# EAGLE design imu shield (EAGLE 7.3.0)
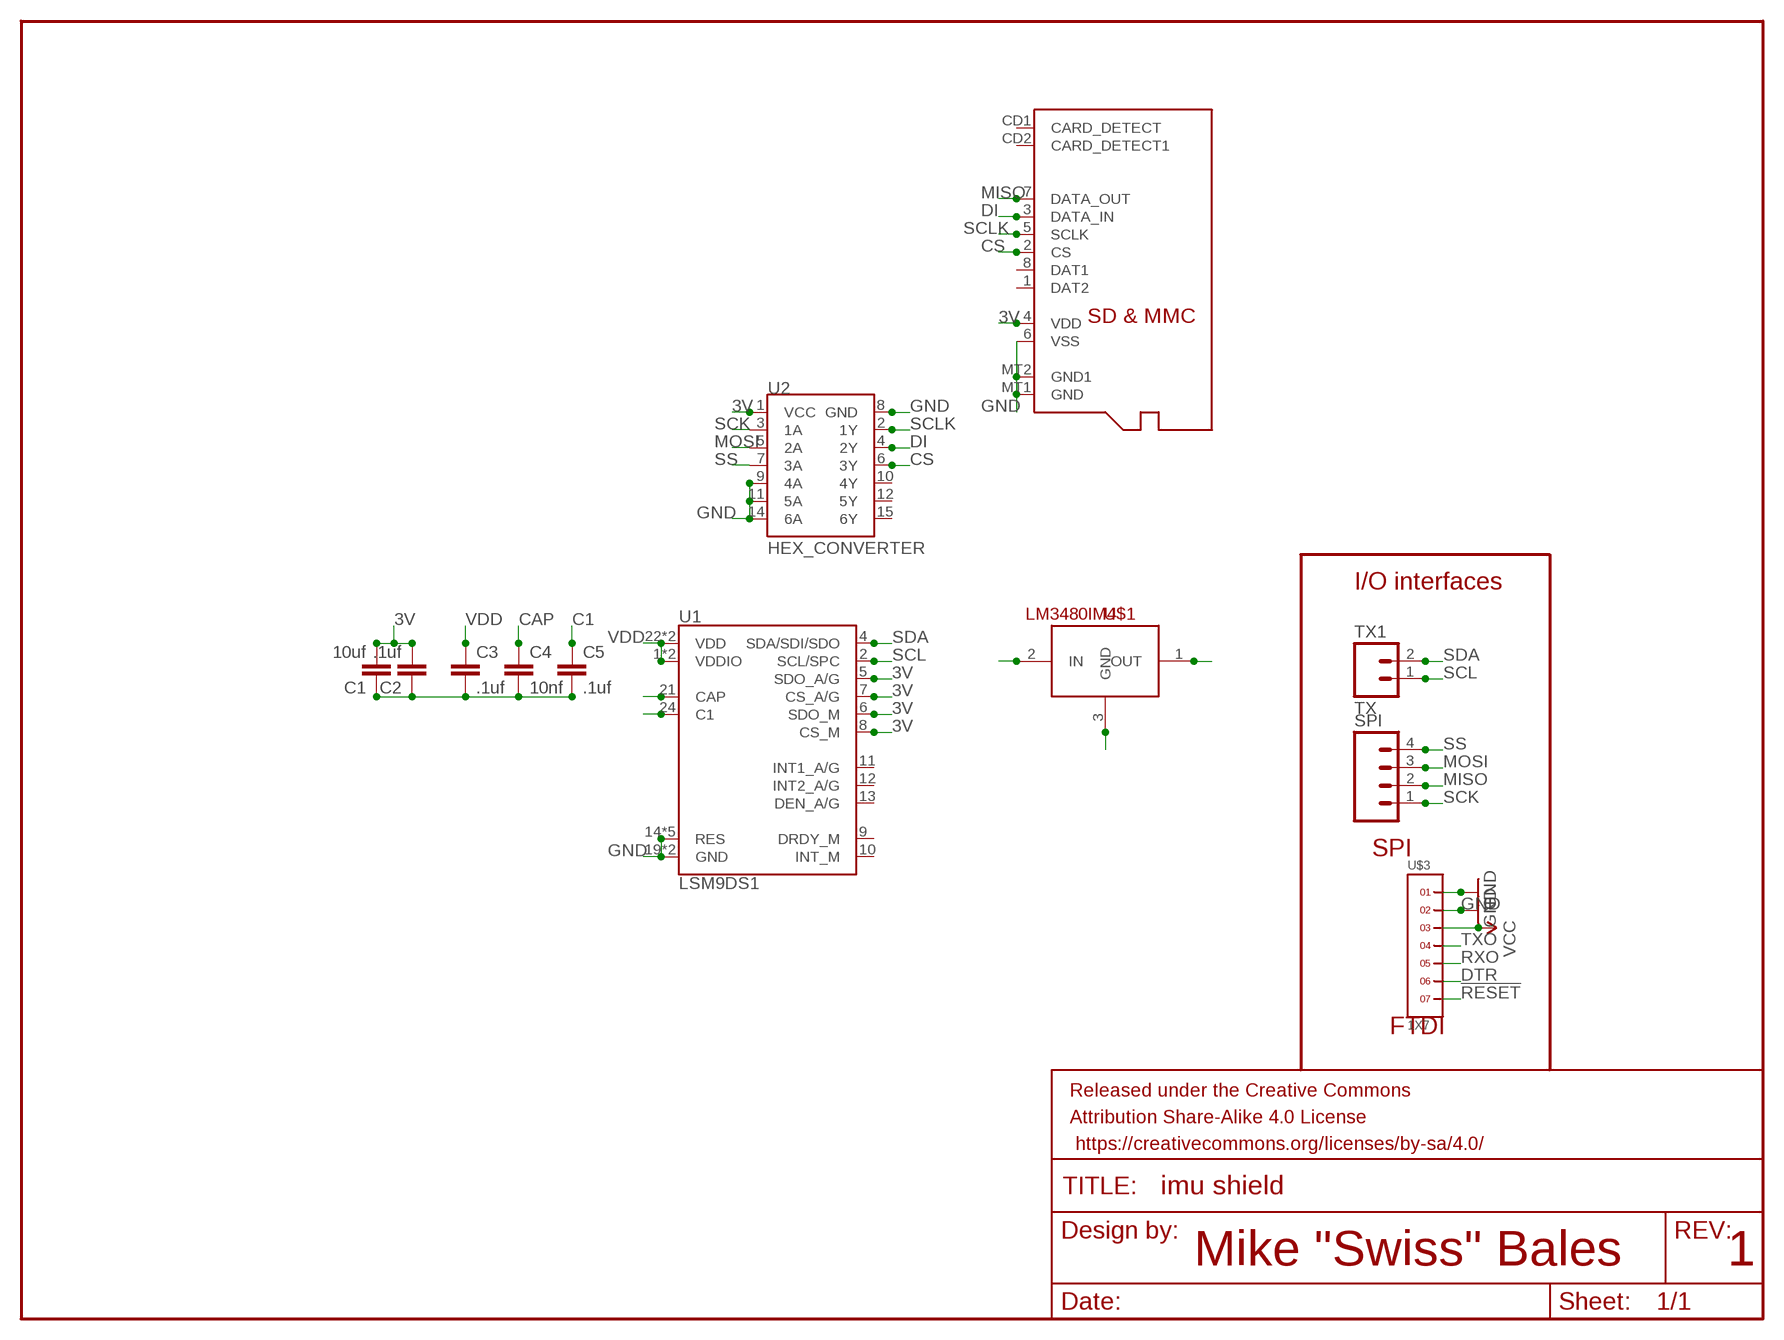
[diagram p0: schematic, sheet 1]

## Parts
C1  10uf  CAP0805  [0805]
C2  .1uf  CAP0805  [0805]
C3  .1uf  CAP0805  [0805]
C4  10nf  CAP0805  [0805]
C5  .1uf  CAP0805  [0805]
FRAME1  FRAME-LETTER  [CREATIVE_COMMONS]
SPI  M04JST-PTH-VERT  [JST-4-PTH-VERT]
TX1  TX  M02JST-PTH-VERT  [JST-2-PTH-VERT]
U1  LSM9DS1  [LGA24-8X4]
U2  HEX_CONVERTER  [SO016]
U$1  LM3480IM4  [SOT23-3]
U$2  MICROSD  [MICROSD]
U$3  1X7  [1X7]

## Nets
3V: C1.2 C2.2 U1.5(SDO_A/G) U1.6(SDO_M) U1.7(CS_A/G) U1.8(CS_M) U2.1(VCC) U$2.4(VDD)
!RESET: U$3.7
C1: C5.1 U1.24(C1)
CAP: C4.1 U1.21(CAP)
CS: U2.6(3Y) U$2.2(CS)
DI: U2.4(2Y) U$2.3(DATA_IN)
DTR: U$3.6
GND: U1.14(RES) U1.15(RES) U1.16(RES) U1.17(RES) U1.18(RES) U1.19(GND) U1.20(GND) U2.8(GND) U2.9(4A) U2.11(5A) U2.14(6A) U$1.3(GND) U$2.6(VSS) U$2.MT1(GND) U$2.MT2(GND1) U$3.1 U$3.2
MISO: SPI.2 U$2.7(DATA_OUT)
MOSI: SPI.3 U2.5(2A)
N$1: C1.1 C2.1 C3.2 C4.2 C5.2
RXO: U$3.5
SCK: SPI.1 U2.3(1A)
SCL: TX1.1 U1.2(SCL/SPC)
SCLK: U2.2(1Y) U$2.5(SCLK)
SDA: TX1.2 U1.4(SDA/SDI/SDO)
SS: SPI.4 U2.7(3A)
TXO: U$3.4
VCC: U$1.2(IN) U$3.3
VDD: C3.1 U1.1(VDDIO) U1.3(VDDIO) U1.22(VDD) U1.23(VDD) U$1.1(OUT)
Unconnected: U1.9(DRDY_M) U1.10(INT_M) U1.11(INT1_A/G) U1.12(INT2_A/G) U1.13(DEN_A/G) U2.10(4Y) U2.12(5Y) U2.15(6Y) U$2.1(DAT2) U$2.8(DAT1) U$2.CD1(CARD_DETECT) U$2.CD2(CARD_DETECT1)

## Notes on the sheet
- I/O interfaces
- SPI
- FTDI
- Mike "Swiss" Bales | 1

## Library data of the parts
C1-C5 = SparkFun-Passives:CAP: Capacitor Standard 0603 ceramic capacitor, and 0.1" leaded capacitor.
FRAME1 = SparkFun-Aesthetics:FRAME-LETTER: Schematic Frame Standard 8.5x11 US Letter frame
SPI = SparkFun-Connectors:M04: Header 4 Standard 4-pin 0.1" header. Use with straight break away headers (SKU : PRT-00116), right angle break away headers (PRT-00553), swiss pins (PRT-00743), machine pins (PRT-00117), and female headers (PRT-00115). Molex polarized connector foot print use with SKU : PRT-08231 with associated crimp pins and housings. 1MM SMD Version SKU: PRT-10208
TX1 = SparkFun-Connectors:M02: Standard 2-pin 0.1" header. Use with - straight break away headers ( PRT-00116) - right angle break away headers (PRT-00553) - swiss pins (PRT-00743) - machine pins (PRT-00117) - female headers (PRT-00115) Molex polarized connector foot print use with: PRT-08233 with associated crimp pins and housings. 2.54_SCREWTERM for use with PRT-10571. 3.5mm Screw Terminal footprints for PRT-08084 5mm Screw Terminal footprints for use with PRT-08432
U1 = SparkFun-Sensors:LSM9DS1: LSM9DS1 3D accelerometer, gyroscope & magnetometer The LSM9DS1 is a system-in-package featuring a 3D digital linear acceleration sensor, a 3D digital angular rate sensor, and a 3D digital magnetic sensor. The LSM9DS1 has a linear acceleration full scale of ±2g/±4g/±8/±16 g, a magnetic field full scale of ±4/±8/±12/±16 gauss and an angular rate of ±245/±500/±2000 dps. The LSM9DS1 includes an I2 C serial bus interface supporting standard and fast mode (100 kHz and 400 kHz) and an SPI serial standard interface. Magnetic, accelerometer and gyroscope sensing can be enabled or set in power-down mode separately for smart power management. The LSM9DS1 is available in a plastic land grid array package (LGA) and it is guaranteed to operate over an extended temperature range from -40 °C to +85 °C.; PROD_ID: IC-12536
U2 = SparkFun-DigitalIC:HEX_CONVERTER: 74HC4050 Hex Buffer Level Shifter SMD SO016; PROD_ID: IC-09604
U$1 = SparkFun-PowerIC:LM3480IM4: Small package linear regulator
U$2 = adafruit:MICROSD: Micro-SD / Transflash card holder with SPI pinout For the 3M # 2908-05WB-MG and/or 4UCON #19656 push-push type
U$3 = headers(2mm):1X7

## Board
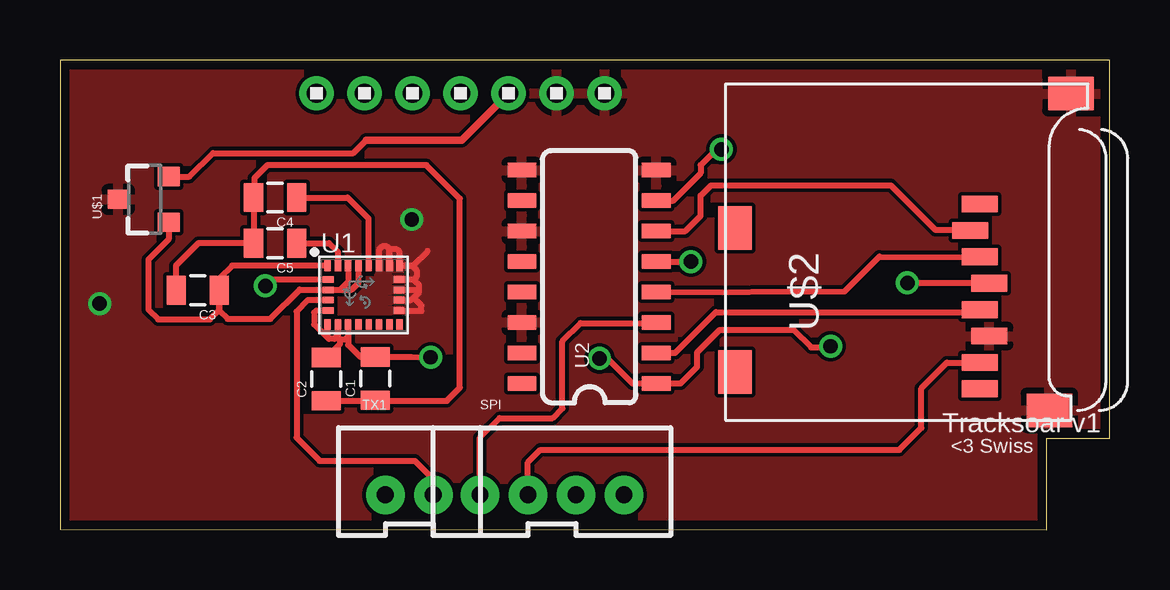
[diagram p1: board, top side]
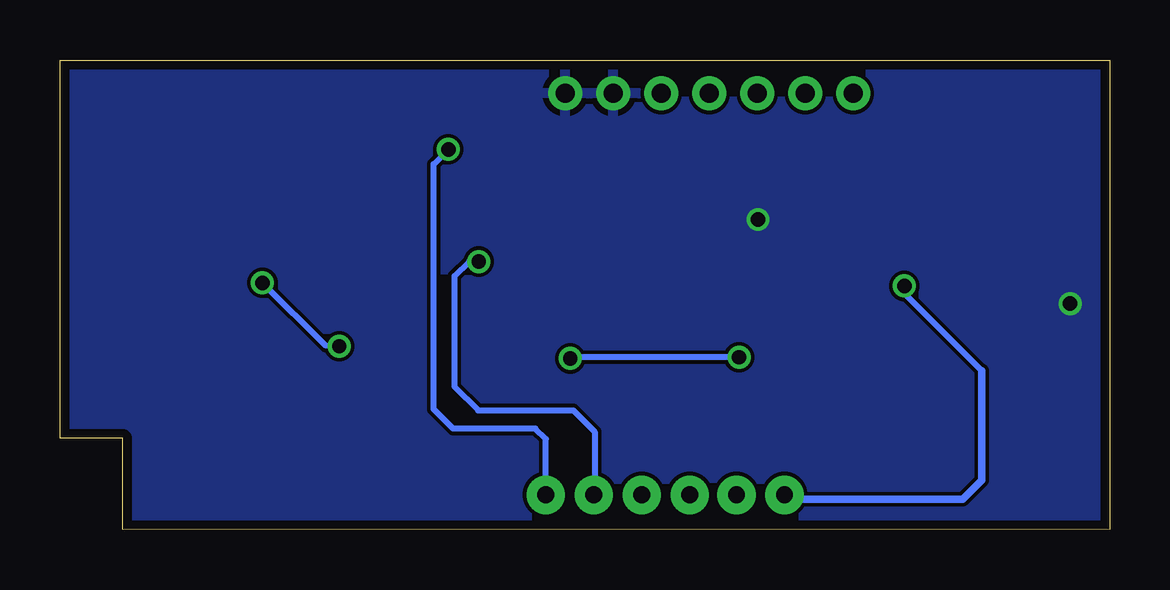
[diagram p2: board, bottom side, seen from below]

Size 43.74 x 19.57 mm. Coordinates in mm from the lower left corner, seen from the top.
Outline: 41.12,0 0,0.03 0,19.57 43.74,19.57 43.74,3.81 41.12,3.81 41.12,0.03
Copper layers (1*16): Top 0.0356mm / dielectric 1.5011mm / Bottom 0.0356mm
Design rules "oshpark-2layer": minimum track width 6mil, minimum drill 13mil, track to track 6mil, track to pad 6mil, pad to pad 6mil, via to via 6mil, smd to smd 6mil, copper to edge 15mil, drill to drill 6mil, minimum pad ring 7mil, minimum via ring 7mil, stop-mask expansion 4mil, vias tented up to drill 0mil, thermal gap 10mil

### Footprints (pad centres in the part's own frame; a part is rotated, then mirrored left to right if it is on the bottom)
0805 = smd 0.8 x 1.2: 1 -0.9,0; 2 0.9,0
JST-4-PTH-VERT = drill 0.7 pad 1.6: 1 -3,-0.55; 2 -1,-0.55; 3 1,-0.55; 4 3,-0.55
JST-2-PTH-VERT = drill 0.7 pad 1.6: 1 -1,-0.55; 2 1,-0.55
LGA24-8X4 = smd 0.27 x 0.45: 1 -1.505,1.225; 6 -1.505,-1.225; 7 -1.075,-1.225; 8 -0.645,-1.225; 9 -0.215,-1.225; 10 0.215,-1.225; 11 0.645,-1.225; 12 1.075,-1.225; 13 1.505,-1.225; 18 1.505,1.225; 19 1.075,1.225; 20 0.645,1.225; 21 0.215,1.225; 22 -0.215,1.225; 23 -0.645,1.225; 24 -1.075,1.225 | smd 0.45 x 0.27: 2 -1.475,0.645; 3 -1.475,0.215; 4 -1.475,-0.215; 5 -1.475,-0.645; 14 1.475,-0.645; 15 1.475,-0.215; 16 1.475,0.215; 17 1.475,0.645
SO016 = smd 0.6 x 1.2: 1 -4.445,-2.8; 2 -3.175,-2.8; 3 -1.905,-2.8; 4 -0.635,-2.8; 5 0.635,-2.8; 6 1.905,-2.8; 7 3.175,-2.8; 8 4.445,-2.8; 9 4.445,2.8; 10 3.175,2.8; 11 1.905,2.8; 12 0.635,2.8; 13 -0.635,2.8; 14 -1.905,2.8; 15 -3.175,2.8; 16 -4.445,2.8
SOT23-3 = smd 0.8 x 0.9: 1 -0.95,-1; 2 0.95,-1; 3 0,1.1
MICROSD = smd 0.7 x 1.5: 1 9,-10.64; 2 7.9,-10.24; 3 6.8,-10.64; 4 5.7,-11.04; 5 4.6,-10.64; 6 3.5,-11.04; 7 2.4,-10.64; 8 1.3,-10.64 | smd 1.8 x 1.4: CD1 2,-0.44; CD2 8,-0.44 | smd 1.4 x 1.9: MT1 0.4,-13.54; MT2 13.6,-14.44
1X7 = drill 0.8 pad 1.422: 1 -6,0; 2 -4,0; 3 -2,0; 4 0,0; 5 2,0; 6 4,0; 7 6,0

### Placement (x,y rotation side)
C1  13.13,6.3 90 top
C2  11.1,6.27 90 top
C3  5.74,9.98 180 top
C4  8.97,13.84 180 top
C5  8.97,11.94 180 top
FRAME1  14.78,-7.8 0 top  (outside the outline)
SPI  20.5,2.01 0 top
TX1  14.55,2.01 0 top
U1  12.65,9.78 0 top
U2  22.05,10.54 90 top
U$1  3.53,13.77 90 top
U$2  27.69,4.57 90 top
U$3  16.69,18.19 180 top

### Tracks (layer width: path | path; a pad name or v marks a point on that pad's centre or on a via)
3V  (via drill 0.6)
  Top 0.254: U1.8 12,8.07 | 12,8.07 11.86,7.92 11.66,7.92 | 11.66,7.92 11.58,8 U1.7 11.57,8.09 11.43,7.95 11.2,7.95 11.15,8 | 11.15,8 U1.6 | 11.66,7.92 11.66,7.73 C2.2 | 12,8.07 12,7.71 12.52,7.19 13.12,7.19 C1.2 14.64,7.2 v15.44,7.19 | U1.5 10.68,9.13 10.59,9.04 10.59,8.56 11.15,8 | v22.48,7.14 22.81,7.14 23.85,6.1 U2.1 25.86,6.1 26.54,6.78 26.54,7.39 27.48,8.33 30.56,8.33 31.29,7.59 32.05,7.59 v32.11,7.65 | v35.31,10.29 38.71,10.29 U$2.4
  Bottom 0.254: v15.44,7.19 22.43,7.19 v22.48,7.14 | v32.11,7.65 32.66,7.67 v35.31,10.29
C1
  Top 0.254: C5.1 11.2,11.94 11.58,11.58 11.58,11.02 U1.24
CAP
  Top 0.254: C4.1 11.99,13.84 12.85,12.98 12.85,11.02 U1.21
CS
  Top 0.254: U2.6 26.06,12.45 26.7,13.08 26.7,13.92 27.13,14.35 34.62,14.35 36.47,12.5 37.9,12.5 U$2.2
DI
  Top 0.254: U2.4 32.69,9.93 34.14,11.38 38.31,11.35 U$2.3
GND  (via drill 0.6)
  Top 0.254: 15.32,11.61 14.71,11 U1.18 | U1.18 14.15,11.58 14.05,11.68 13.72,11.68 U1.19 13.72,11.7 13.61,11.81 13.44,11.81 13.28,11.66 13.28,11.01 U1.20 | U1.18 14.68,11 14.86,10.82 14.86,10.54 14.73,10.41 | 14.73,10.41 14.13,10.41 U1.17 | U1.16 14.87,9.99 14.96,9.91 | 14.96,9.91 14.96,10.19 14.73,10.41 | U1.15 14.62,9.56 14.73,9.68 | 14.73,9.68 14.96,9.91 | U1.14 15.05,9.13 15.06,9.12 15.06,9.35 14.73,9.68
  other vias: 14.66,12.93 1.65,9.42
  pour Top: 0,19.58 43.74,19.58 43.74,0 0,0.03 0.05,3.78
  pour Bottom: 0,19.58 43.74,19.58 43.74,0 0,0.03 0.05,3.78
MISO
  Top 0.254: SPI.2 19.5,2.81 20.02,3.33 34.98,3.33 35.89,4.24 35.89,5.89 36.96,6.96 38.31,6.96 U$2.7
MOSI  (via drill 0.6)
  Top 0.254: U2.5 v26.29,11.18
  Bottom 0.254: v26.29,11.18 26.7,11.18 27.31,10.57 27.31,5.97 26.31,4.98 22.35,4.98 21.46,4.09 21.46,1.49 SPI.3
N$1
  Top 0.254: C3.2 4.83,11 5.77,11.94 C5.2 C4.2 8.1,13.88 8.1,14.66 8.64,15.19 15.27,15.19 16.66,13.79 16.66,5.92 16.12,5.37 C2.1 13.11,5.37 C1.1
SCK
  Top 0.254: SPI.1 17.5,3.83 18.31,4.65 20.52,4.65 20.93,5.05 20.93,7.85 21.69,8.61 24.82,8.61 U2.3
SCL  (via drill 0.6)
  Top 0.254: U1.2 8.82,10.42 v8.56,10.16
  Bottom 0.254: v8.56,10.16 8.56,9.86 5.33,6.63 | TX1.1
  Bottom 0.305: 5.33,6.63 5.33,2.06 6.12,1.27 13.37,1.27 TX1.1
SCLK
  Top 0.254: U2.2 25.63,7.37 27.33,9.07 38.22,9.07 U$2.5
SDA
  Top 0.254: U1.4 10.33,9.56 9.86,9.09 9.86,3.84 10.82,2.87 14.78,2.87 15.62,2.03 15.62,1.52 TX1.2 15.57,1.47
SS  (via drill 0.6)
  Top 0.254: v27.56,15.85 27.36,15.85 26.7,15.19 26.7,14.86 25.53,13.69 24.87,13.69 U2.7
  Bottom 0.254: SPI.4 23.5,3.79 23.93,4.22 27.36,4.22 28.17,5.03 28.17,15.24 v27.56,15.85
VCC
  Top 0.254: U$1.2 5.4,14.72 6.38,15.7 12.22,15.7 12.75,16.23
  Top 0.305: 12.75,16.23 16.73,16.23 U$3.3
VDD
  Top 0.254: U$1.1 4.53,12.1 3.68,11.25 3.68,9.17 4.09,8.76 6.25,8.76 6.63,9.14 6.63,9.97 C3.1 | 11.16,9.98 U1.3 11.16,10.01 | C3.1 6.64,9.13 6.99,8.79 8.76,8.79 9.98,10.01 11.16,10.01 | 11.16,10.01 11.68,10.01 | 11.68,10.01 12.17,10.01 12.45,10.29 12.45,10.99 U1.22 | U1.1 7.17,11 6.65,10.49 6.65,10 C3.1 | U1.23 12,10.33 11.68,10.01

### Text on the board
tNames: Tracksoar v1 | <3 Swiss